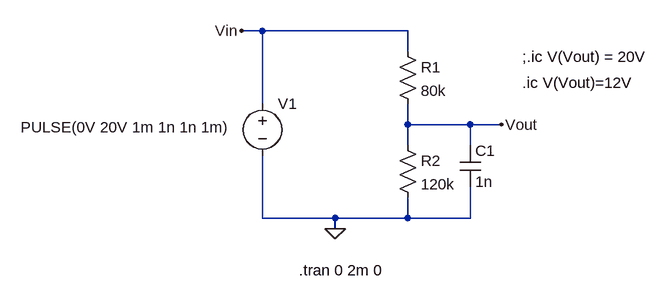
[diagram p0: schematic Initial_Conditions_RC_Response.asc]
Initial_Conditions_RC_Response.asc, the LTspice schematic file:
Version 4
SHEET 1 880 680
WIRE -32 -64 -64 -64
WIRE 192 -64 -32 -64
WIRE 192 -32 192 -64
WIRE -32 48 -32 -64
WIRE 192 80 192 48
WIRE 288 80 192 80
WIRE 336 80 288 80
WIRE 192 112 192 80
WIRE 288 112 288 80
WIRE -32 224 -32 128
WIRE 80 224 -32 224
WIRE 192 224 192 192
WIRE 192 224 80 224
WIRE 288 224 288 176
WIRE 288 224 192 224
WIRE 80 240 80 224
FLAG 80 240 0
FLAG -64 -64 Vin
FLAG 336 80 Vout
SYMBOL res 176 -48 R0
SYMATTR InstName R1
SYMATTR Value 80k
SYMATTR SpiceLine tol=5
SYMBOL voltage -32 32 R0
WINDOW 3 -372 52 Left 2
WINDOW 123 0 0 Left 0
WINDOW 39 0 0 Left 0
SYMATTR Value PULSE(0V 20V 1m 1n 1n 1m)
SYMATTR InstName V1
SYMBOL res 176 96 R0
SYMATTR InstName R2
SYMATTR Value 120k
SYMATTR SpiceLine tol=5
SYMBOL cap 272 112 R0
SYMATTR InstName C1
SYMATTR Value 1n
TEXT 24 304 Left 2 !.tran 0 2m 0
TEXT 368 16 Left 2 !.ic V(Vout)=12V
TEXT 368 -24 Left 2 !;.ic V(Vout) = 20V

The netlist it stands for:
* Initial_Conditions_RC_Response.asc
R1 Vin Vout 80k tol=5
V1 Vin 0 PULSE(0V 20V 1m 1n 1n 1m)
R2 Vout 0 120k tol=5
C1 Vout 0 1n
.tran 0 2m 0
.ic V(Vout)=12V
;.ic V(Vout) = 20V
.backanno
.end

* Results of the author's LTspice run, read from the files saved beside the schematic
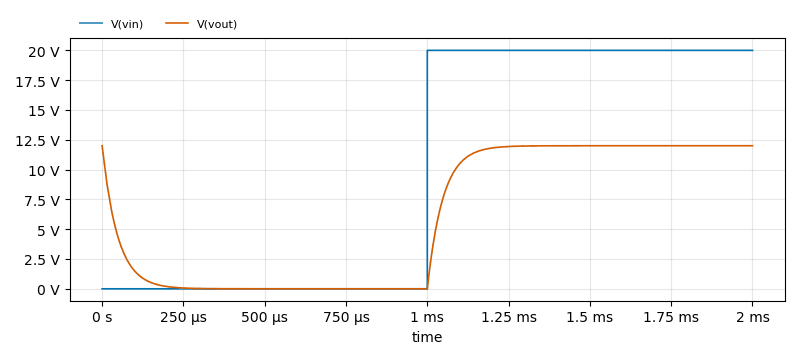
[diagram p1: Transient Analysis of Initial_Conditions_RC_Response.asc, plotted from the saved traces]
* Transient Analysis, 1 run:
*   V(vin): min 0 V, max 20 V, average 10 V, rms 14.14 V, last 20 V
*   V(vout): min 0 V, max 12 V, average 6.001 V, rms 8.282 V, last 12 V